# Altium schematic sheet MASTER.SchDoc
size A; SheetNumber: 5; SheetTotal: 9
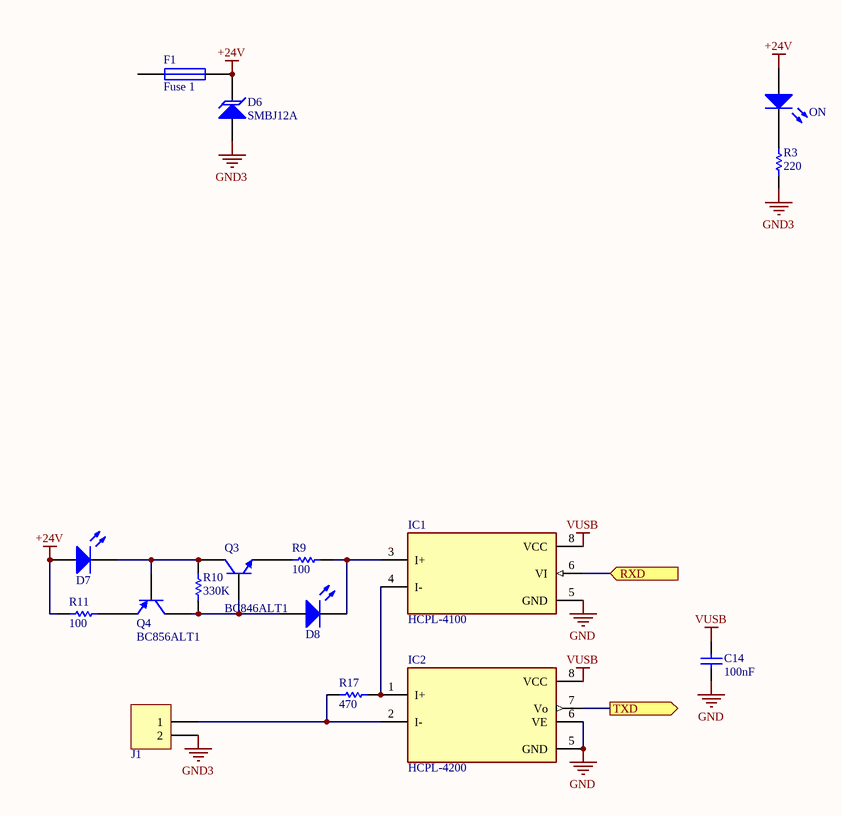
[diagram p0: MASTER.SchDoc]

## Parts
C14  100nF  [C603]
D6  SMBJ12A  [DO-214AA]
D7  LED  [LED-1206]  (value not drawn)
D8  LED  [LED-1206]  (value not drawn)
F1  Fuse 1  [PTC-0805]
IC1  HCPL-4100  [DIP-8]
IC2  HCPL-4200  [DIP-8]
J1  CONN-2  [XH-2]  (value not drawn)
ON  LED  [LED-1206]  (value not drawn)
Q3  BC846ALT1  [SOT-23]
Q4  BC856ALT1  [SOT-23]
R3  220  [R805]
R9  100  [R805]
R10  330K  [R805]
R11  100  [R805]
R17  470  [R805]

## Ports
RXD (in), TXD (out)

## Nets
+24V: D6.2(K) D7.1(A) F1.2 ON.1(A) R11.2
GND: C14.1 IC1.5(GND) IC2.5(GND) IC2.6(VE)
GND3: D6.1(A) J1.2 R3.1
VUSB: C14.2 IC1.8(VCC) IC2.8(VCC)
RXD: IC1.6(VI) ; port RXD
TXD: IC2.7(Vo) ; port TXD
NetD7_2: D7.2(K) Q3.3(C) Q4.1(B) R10.1
NetD8_1: D8.1(A) Q3.1(B) Q4.3(C) R10.2
NetD8_2: D8.2(K) IC1.3(I+) R9.1
NetIC1_4: IC1.4(I-) IC2.1(I+) R17.2
NetIC2_2: IC2.2(I-) J1.1 R17.1
NetON_2: ON.2(K) R3.2
NetQ3_2: Q3.2(E) R9.2
NetQ4_2: Q4.2(E) R11.1

Not connected (* = marked no-connect by the designer): F1 1

## Library data of the parts
C14 = Cap: Capacitor; Designer: Parsa Malekpour; Value: 100nF
D6 = SMBJxxA: Surface Mount Transient Voltage Suppressors Diode; Parameter 1: *
F1 = Fuse 1: Fuse; Published: 8-Jun-2000; LatestRevisionDate: 17-Jul-2002; LatestRevisionNote: Re-released for DXP Platform.; PackageReference: PIN-W2/E2.8; Publisher: Altium Limited; PackageDescription: Thru-Hole; 2 Leads
IC1 = HCPL-4100: <b>Isolation Amplifer</b><p> Source: http://www.avagotech.com/docs/AV02-0410EN; MF: {'manufacturer': u'Broadcom Limited'}; Package: None; Value: *; Price: None; MP: HCPL-4100; Availability: Unavailable
IC2 = HCPL-4200: Optically Coupled 20 mA Current Loop Receiver; MF: {'manufacturer': u'Broadcom Limited'}; Package: None; Value: *; Price: None; MP: HCPL-4100; Availability: Unavailable
Q3 = BC846ALT1: General Purpose Transistor NPN Silicon; Published: 29-Sep-2000; LatestRevisionDate: 17-Jul-2002; LatestRevisionNote: Re-released for DXP Platform.; DatasheetVersion: 1997; PackageVersion: 1997; PackageReference: 318-08; Publisher: Altium Limited; PackageDescription: SOT-23; 3 Leads; Body 3.0 x 2.6 mm, inc. leads (LxW max); ComponentLink1Description: Manufacturer Link; ComponentLink1URL: http://www.onsemi.com/site/products/landing?taxonomyID=194; ComponentLink2Description: Datasheet; ComponentLink2URL: http://www.onsemi.com/pub/Collateral/BC846ALT1-D.PDF
Q4 = BC856ALT1: General Purpose Transistor PNP Silicon; Published: 29-Sep-2000; LatestRevisionDate: 17-Jul-2002; LatestRevisionNote: Re-released for DXP Platform.; DatasheetVersion: 1997; PackageVersion: 1997; PackageReference: 318-08; Publisher: Altium Limited; PackageDescription: SOT-23; 3 Leads; Body 3.0 x 2.6 mm, inc. leads (LxW max); ComponentLink1Description: Manufacturer Link; ComponentLink1URL: http://www.onsemi.com/site/products/landing?taxonomyID=194; ComponentLink2Description: Datasheet; ComponentLink2URL: http://www.onsemi.com/pub/Collateral/BC856ALT1-D.PDF
R3 R9-R11 R17 = Resistor: Designer: Parsa Malekpour
  R3: Value: 220
  R9 R11: Value: 100
  R10: Value: 330K
  R17: Value: 470